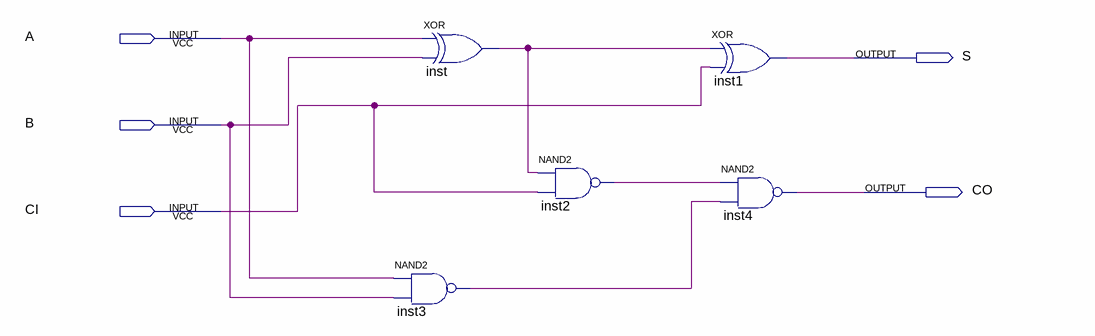
[diagram p0: schematic sheet]
// Quartus schematic Adder.bdf as structural Verilog: 5 symbols, 5 pins
module Adder (
  input  A,
  input  B,
  input  CI,
  output S,
  output CO
);

  wire inst2_out, inst3_out, inst_out;

  nand inst3 (inst3_out, A, B);
  xor inst (inst_out, A, B);
  nand inst2 (inst2_out, inst_out, CI);
  xor inst1 (S, inst_out, CI);
  nand inst4 (CO, inst2_out, inst3_out);
endmodule
